# Altium schematic sheet Crystal 32k CM200.SchDoc
size A4
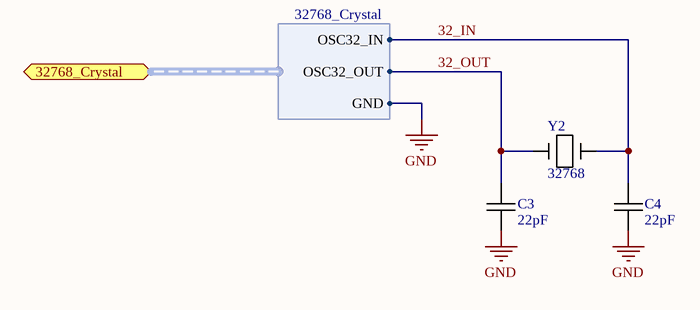
[diagram p0: Crystal 32k CM200.SchDoc]

## Parts
C3  22pF  [0603C-GENERIC]
C4  22pF  [0603C-GENERIC]
Y2  32768  [CM200S]

## Ports
32768_Crystal (harness 32768_Crystal)

## Harnesses
32768_Crystal: OSC32_IN, OSC32_OUT, GND

## Nets
GND: C3.1 C4.2 Y2.2 Y2.4 ; port 32768_Crystal.GND
32_IN: C4.1 Y2.3 ; port 32768_Crystal.OSC32_IN
32_OUT: C3.2 Y2.1 ; port 32768_Crystal.OSC32_OUT

## Library data of the parts
C3 C4 = 0603C-22PF-50V-C0G-PAN: CAPACITOR 0603 CERAMIC; Manufacturer Part Number: ECJ-1VC1H220J; Manufacturer: Panasonic - ECG; Reel: C10; Tolerance: ±5%; Temperature Coefficient: C0G, NP0; Voltage - Rated: 50V; Supplier 1: Digi-Key; Features: General Purpose; Lead Spacing: -; Supplier: Digi-Key; Capacitance: 22pF; Packaging: Tape & Reel (TR); Mounting Type: Surface Mount, MLCC; RoHS: RoHS Compliant; Operating Temperature: -55°C ~ 125°C; Thickness: 0.80mm; Package / Case: 0603 (1608 metric); Category: Capacitors; Supplier Part Number 1: PCC220ACVTR-ND; Supplier Part Number: PCC220ACVTR-ND
Y2 = 3225 CRYSTAL: pin to pad: 3>4 4>3